# EAGLE schematic ALU (EAGLE 9.6.2)
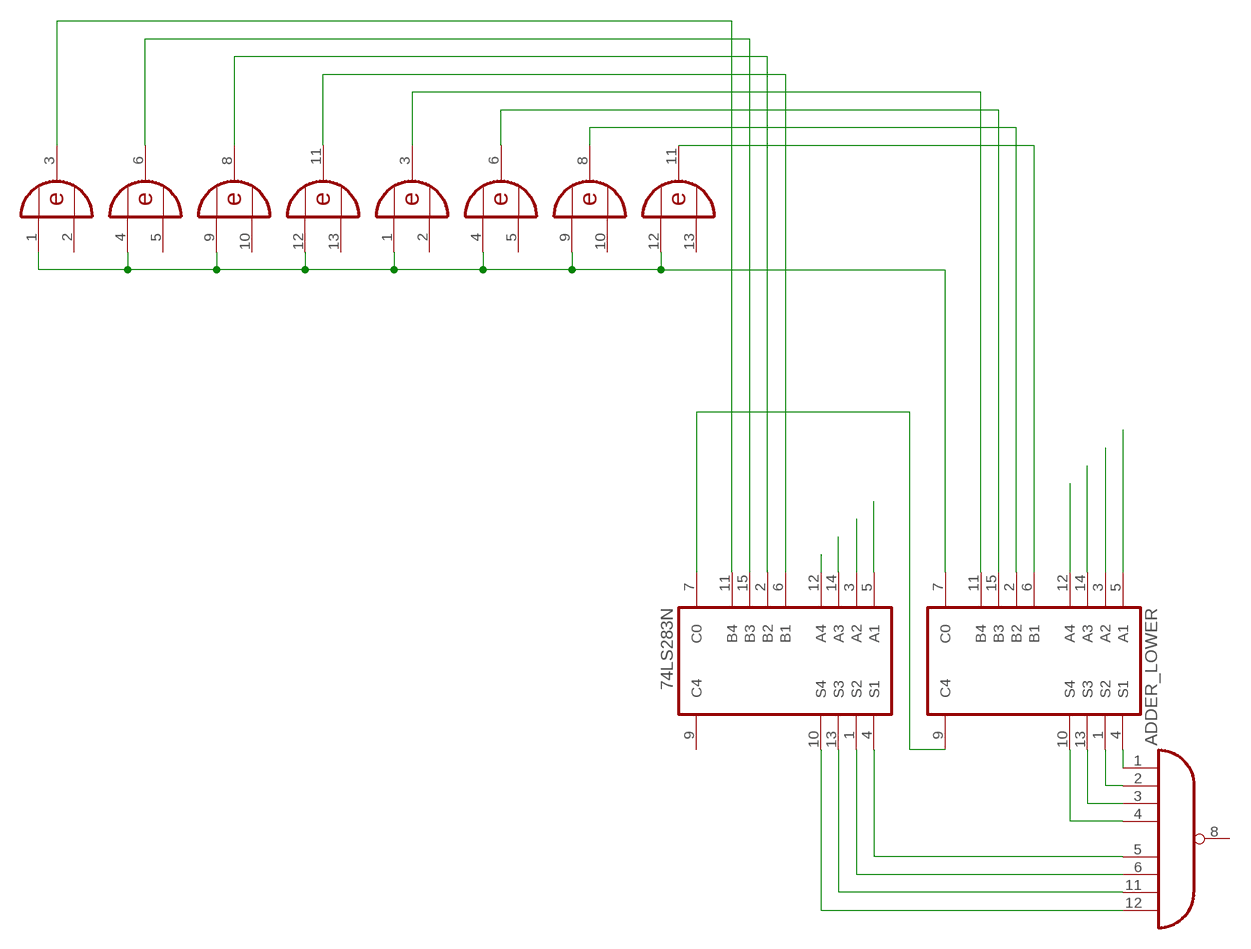
[diagram p0: schematic, sheet 1]

## Parts
ADDER_LOWER  74LS283N  [DIL16]
ADDER_UPPER  74LS283N  [DIL16]
AND_GATE1  74LS30N  [DIL14]
SUBTRACT_INVERTER_LOWER  74LS86N  [DIL14]
SUBTRACT_INVERTER_UPPER  74LS86N  [DIL14]

## Nets
N$10: ADDER_LOWER.10(S4) AND_GATE1.4(I3)
N$12: ADDER_LOWER.13(S3) AND_GATE1.3(I2)
N$15: ADDER_LOWER.1(S2) AND_GATE1.2(I1)
N$17: ADDER_LOWER.4(S1) AND_GATE1.1(I0)
N$19: ADDER_LOWER.6(B1) SUBTRACT_INVERTER_LOWER.11(D:O)
N$20: ADDER_LOWER.2(B2) SUBTRACT_INVERTER_LOWER.8(C:O)
N$21: ADDER_LOWER.15(B3) SUBTRACT_INVERTER_LOWER.6(B:O)
N$22: ADDER_LOWER.11(B4) SUBTRACT_INVERTER_LOWER.3(A:O)
N$23: ADDER_UPPER.6(B1) SUBTRACT_INVERTER_UPPER.11(D:O)
N$24: ADDER_UPPER.2(B2) SUBTRACT_INVERTER_UPPER.8(C:O)
N$25: ADDER_UPPER.15(B3) SUBTRACT_INVERTER_UPPER.6(B:O)
N$27: ADDER_UPPER.11(B4) SUBTRACT_INVERTER_UPPER.3(A:O)
REG_A_1PLACE: ADDER_LOWER.5(A1)
REG_A_2PLACE: ADDER_LOWER.3(A2)
REG_A_4PLACE: ADDER_LOWER.14(A3)
REG_A_8PLACE: ADDER_LOWER.12(A4)
REG_A_16PLACE: ADDER_UPPER.5(A1)
REG_A_32PLACE: ADDER_UPPER.3(A2)
REG_A_64PLACE: ADDER_UPPER.14(A3)
REG_A_128PLACE: ADDER_UPPER.12(A4)
SUBTRACT: ADDER_LOWER.7(C0) SUBTRACT_INVERTER_LOWER.1(A:I0) SUBTRACT_INVERTER_LOWER.4(B:I0) SUBTRACT_INVERTER_LOWER.9(C:I0) SUBTRACT_INVERTER_LOWER.12(D:I0) SUBTRACT_INVERTER_UPPER.1(A:I0) SUBTRACT_INVERTER_UPPER.4(B:I0) SUBTRACT_INVERTER_UPPER.9(C:I0) SUBTRACT_INVERTER_UPPER.12(D:I0)
SUM_16: ADDER_UPPER.4(S1) AND_GATE1.5(I4)
SUM_32: ADDER_UPPER.1(S2) AND_GATE1.6(I5)
SUM_64: ADDER_UPPER.13(S3) AND_GATE1.11(I6)
SUM_128: ADDER_UPPER.10(S4) AND_GATE1.12(I7)
SUM_CARRY: ADDER_LOWER.9(C4) ADDER_UPPER.7(C0)
Unconnected: ADDER_UPPER.9(C4) AND_GATE1.8(O) SUBTRACT_INVERTER_LOWER.2(A:I1) SUBTRACT_INVERTER_LOWER.5(B:I1) SUBTRACT_INVERTER_LOWER.10(C:I1) SUBTRACT_INVERTER_LOWER.13(D:I1) SUBTRACT_INVERTER_UPPER.2(A:I1) SUBTRACT_INVERTER_UPPER.5(B:I1) SUBTRACT_INVERTER_UPPER.10(C:I1) SUBTRACT_INVERTER_UPPER.13(D:I1)

## Power pins joined to a net without a drawn wire
GND: ADDER_LOWER.8(GND) ADDER_UPPER.8(GND) AND_GATE1.7(GND) SUBTRACT_INVERTER_LOWER.7(P:GND) SUBTRACT_INVERTER_UPPER.7(P:GND)
VCC: ADDER_LOWER.16(VCC) ADDER_UPPER.16(VCC) AND_GATE1.14(VCC) SUBTRACT_INVERTER_LOWER.14(P:VCC) SUBTRACT_INVERTER_UPPER.14(P:VCC)

## Library data of the parts
ADDER_LOWER ADDER_UPPER = 74xx-eu:74*283: 4-bit binary FULL ADDER, fast carry
AND_GATE1 = 74xx-eu:74*30: 8-input NAND gate
SUBTRACT_INVERTER_LOWER SUBTRACT_INVERTER_UPPER = 74xx-eu:74*86: Quad 2-input EXCLUSIVE-OR (XOR) gate